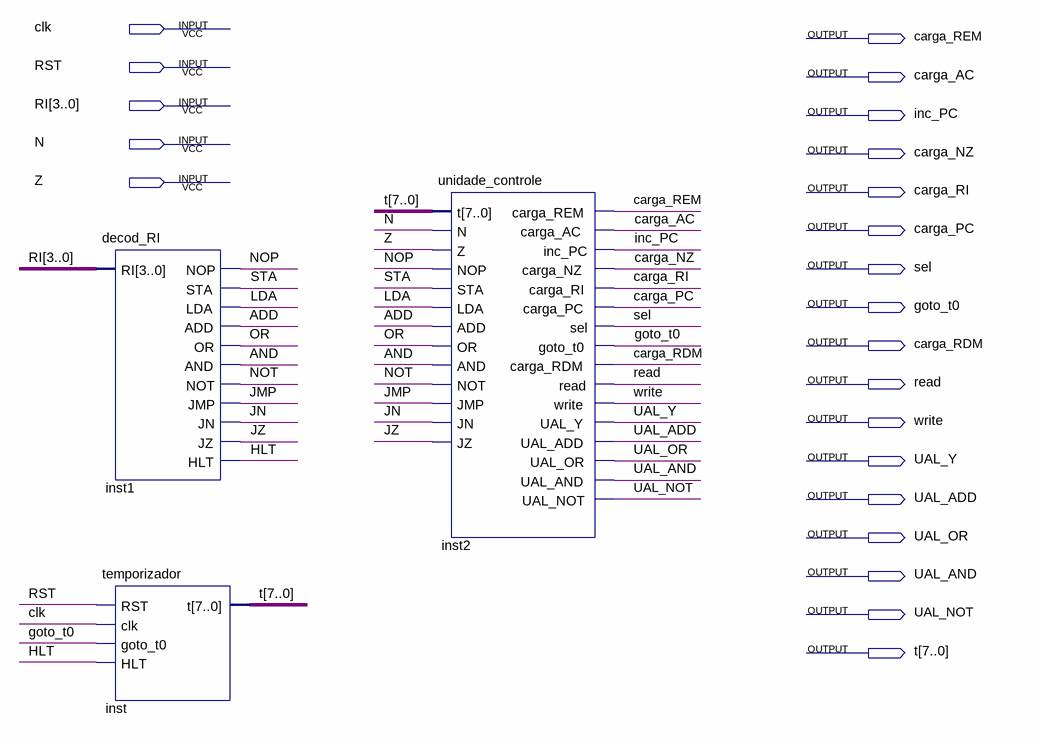
[diagram p0: schematic sheet]
// Quartus schematic LAB9.bdf as structural Verilog: 3 symbols, 22 pins
module LAB9 (
  input  clk,
  input  RST,
  input  [3:0] RI,
  input  N,
  input  Z,
  output carga_REM,
  output carga_AC,
  output inc_PC,
  output carga_NZ,
  output carga_RI,
  output carga_PC,
  output sel,
  output goto_t0,
  output carga_RDM,
  output read,
  output write,
  output UAL_Y,
  output UAL_ADD,
  output UAL_OR,
  output UAL_AND,
  output UAL_NOT,
  output [7:0] t
);

  wire ADD, AND, HLT, JMP, JN, JZ, LDA, NOP, NOT, OR, STA;

  decod_RI inst1 (
    .RI(RI), .NOP(NOP), .STA(STA), .LDA(LDA), .ADD(ADD), .OR(OR), .AND(AND), .NOT(NOT), .JMP(JMP), .JN(JN),
    .JZ(JZ), .HLT(HLT));
  temporizador inst (.RST(RST), .clk(clk), .goto_t0(goto_t0), .HLT(HLT), .t(t));
  unidade_controle inst2 (
    .t(t), .N(N), .Z(Z), .NOP(NOP), .STA(STA), .LDA(LDA), .ADD(ADD), .OR(OR), .AND(AND), .NOT(NOT),
    .JMP(JMP), .JN(JN), .JZ(JZ), .carga_REM(carga_REM), .carga_AC(carga_AC), .inc_PC(inc_PC),
    .carga_NZ(carga_NZ), .carga_RI(carga_RI), .carga_PC(carga_PC), .sel(sel), .goto_t0(goto_t0),
    .carga_RDM(carga_RDM), .read(read), .write(write), .UAL_Y(UAL_Y), .UAL_ADD(UAL_ADD), .UAL_OR(UAL_OR),
    .UAL_AND(UAL_AND), .UAL_NOT(UAL_NOT));
endmodule
